# Altium project NNLightSwitcher.PrjPcb (part 3 of 5)

## Sheet NNLightSwitcher_connectors.SchDoc
size A3
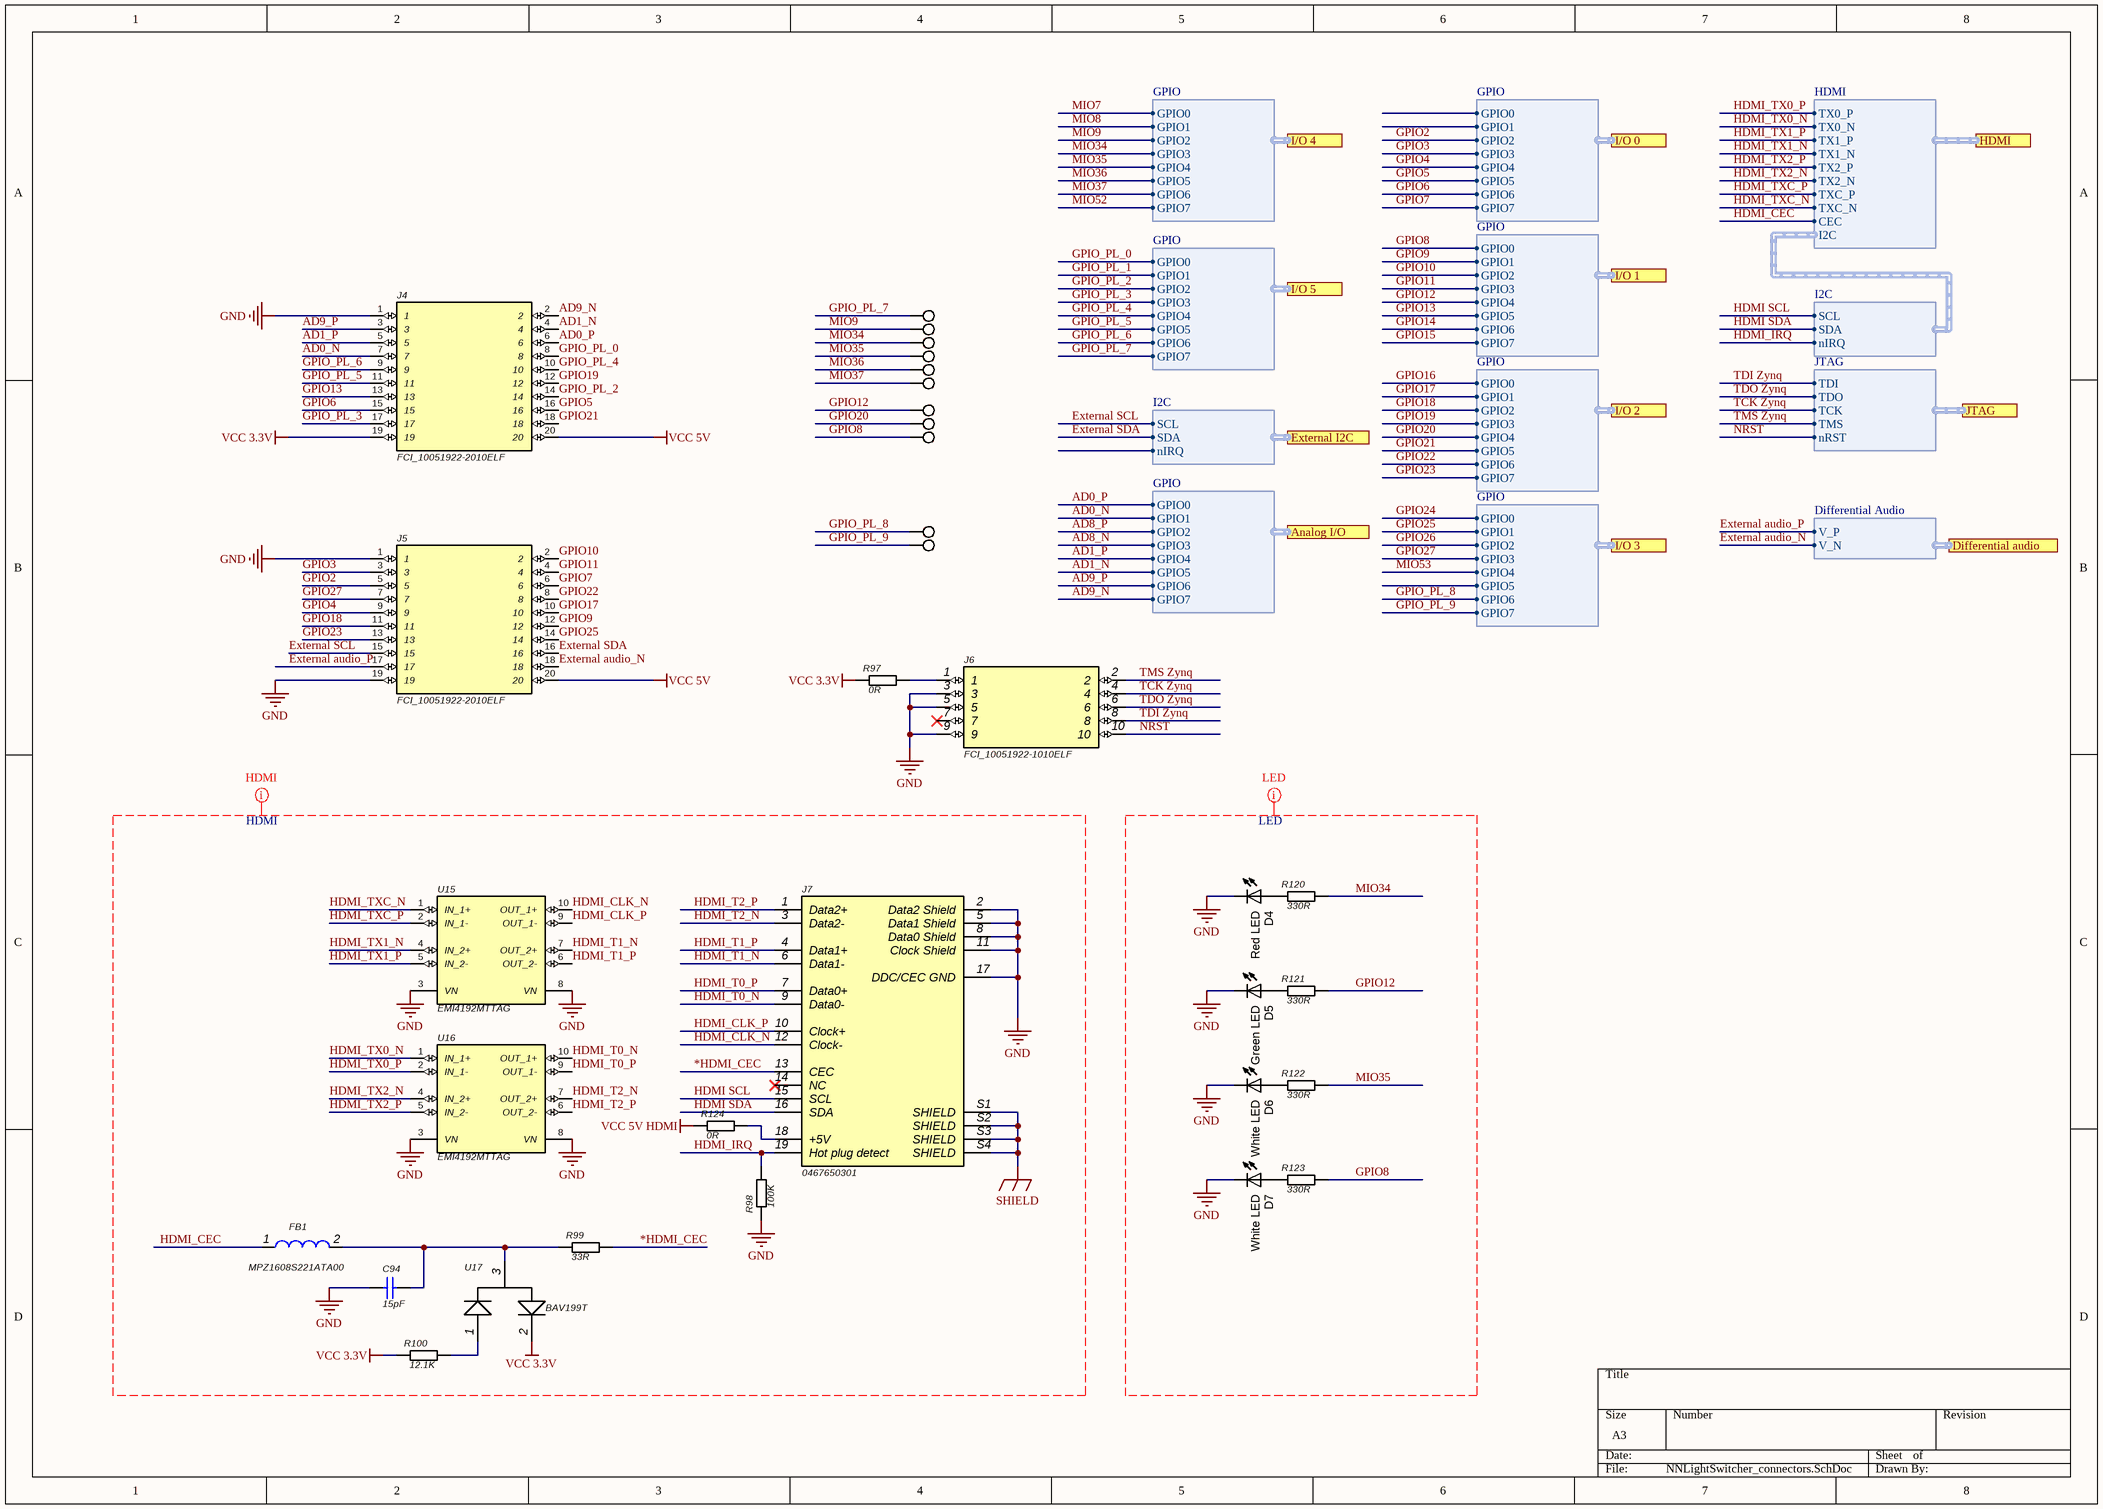
[diagram p10: NNLightSwitcher_connectors.SchDoc]

### Parts
C94  15pF  [0402]
D4  Red LED  [*LED_SML-P11UTT86R_SML-P11MTT86(Primary)]
D5  Green LED  [*LED_SML-P11UTT86R_SML-P11MTT86(Primary)]
D6  White LED  [*LED_SML-P11UTT86R_SML-P11MTT86(Primary)]
D7  White LED  [*LED_SML-P11UTT86R_SML-P11MTT86(Primary)]
FB1  MPZ1608S221ATA00  [*0603]
J4  FCI_10051922-2010ELF  [*FCI_10051922-2010ELF]
J5  FCI_10051922-2010ELF  [*FCI_10051922-2010ELF]
J6  FCI_10051922-1010ELF  [*FCI_10051922-1010ELF]
J7  0467650301  [MOLEX_0467650301_0467650301(Primary)]
R97  0R  [0402]
R98  100K  [0402]
R99  33R  [0402]
R100  12.1K  [0402]
R120  330R  [0402]
R121  330R  [0402]
R122  330R  [0402]
R123  330R  [0402]
R124  0R  [0402]
TP50  Test point  [Testpoint_with_pad]  (value not drawn)
TP51  Test point  [Testpoint_Keystone_Miniature]  (value not drawn)
TP52  Test point  [Testpoint_Keystone_Miniature]  (value not drawn)
TP53  Test point  [Testpoint_Keystone_Miniature]  (value not drawn)
TP54  Test point  [Testpoint_Keystone_Miniature]  (value not drawn)
TP55  Test point  [Testpoint_Keystone_Miniature]  (value not drawn)
TP63  Test point  [Testpoint_with_pad]  (value not drawn)
TP64  Test point  [Testpoint_with_pad]  (value not drawn)
TP65  Test point  [Testpoint_with_pad]  (value not drawn)
TP67  Test point  [Testpoint_with_pad]  (value not drawn)
TP70  Test point  [Testpoint_with_pad]  (value not drawn)
U15  EMI4192MTTAG  [ONSC-WDFN-10-511BM-01_V]
U16  EMI4192MTTAG  [ONSC-WDFN-10-511BM-01_V]
U17  BAV199T  [*SOT95P240X110-3N]

### Ports
Analog I/O (harness GPIO), Differential audio (harness Differential Audio), External I2C (harness I2C), HDMI (harness HDMI), I/O 0 (harness GPIO), I/O 1 (harness GPIO), I/O 2 (harness GPIO), I/O 3 (harness GPIO), I/O 4 (harness GPIO), I/O 5 (harness GPIO), JTAG (harness JTAG)

### Harnesses
GPIO: GPIO7, GPIO6, GPIO5, GPIO4, GPIO3, GPIO2, GPIO1, GPIO0
HDMI: TXC_N, TXC_P, TX2_N, TX2_P, TX1_N, TX1_P, TX0_N, TX0_P, CEC, I2C
I2C: SDA, SCL, nIRQ
JTAG: TMS, TCK, TDO, TDI, nRST
Differential Audio: V_N, V_P

### Nets
GND: C94.2 D4.C D5.C D6.C D7.C J4.1 J5.1 J5.19 J6.3 J6.5 J6.9 J7.2(Data2_Shield) J7.5(Data1_Shield) J7.8(Data0_Shield) J7.11(Clock_Shield) J7.17(DDC/CEC_GND) R98.1 U15.3(VN) U15.8(VN) U16.3(VN) U16.8(VN)
SHIELD: J7.S1(SHIELD) J7.S2(SHIELD) J7.S3(SHIELD) J7.S4(SHIELD)
VCC 3.3V: J4.19 R97.1 R100.1 U17.2(CATHODE)
VCC 5V: J4.20 J5.20
VCC 5V HDMI: R124.1
*HDMI_CEC: J7.13(CEC) R99.2
AD0_N: J4.7 ; port Analog I/O.GPIO1
AD0_P: J4.6 ; port Analog I/O.GPIO0
AD1_N: J4.4 ; port Analog I/O.GPIO5
AD1_P: J4.5 ; port Analog I/O.GPIO4
AD9_N: J4.2 ; port Analog I/O.GPIO7
AD9_P: J4.3 ; port Analog I/O.GPIO6
External audio_N: J5.18 ; port Differential audio.V_N  [project net Audio_N]
External audio_P: J5.17 ; port Differential audio.V_P  [project net Audio_P]
External SCL: J5.15 ; port External I2C.SCL
External SDA: J5.16 ; port External I2C.SDA
GPIO2: J5.5 ; port I/O 0.GPIO2
GPIO3: J5.3 ; port I/O 0.GPIO3
GPIO4: J5.9 ; port I/O 0.GPIO4
GPIO5: J4.16 ; port I/O 0.GPIO5
GPIO6: J4.15 ; port I/O 0.GPIO6
GPIO7: J5.6 ; port I/O 0.GPIO7
GPIO8: R123.2 TP65.1 ; port I/O 1.GPIO0
GPIO9: J5.12 ; port I/O 1.GPIO1
GPIO10: J5.2 ; port I/O 1.GPIO2
GPIO11: J5.4 ; port I/O 1.GPIO3
GPIO12: R121.2 TP63.1 ; port I/O 1.GPIO4
GPIO13: J4.13 ; port I/O 1.GPIO5
GPIO17: J5.10 ; port I/O 2.GPIO1
GPIO18: J5.11 ; port I/O 2.GPIO2
GPIO19: J4.12 ; port I/O 2.GPIO3
GPIO20: TP64.1 ; port I/O 2.GPIO4
GPIO21: J4.18 ; port I/O 2.GPIO5
GPIO22: J5.8 ; port I/O 2.GPIO6
GPIO23: J5.13 ; port I/O 2.GPIO7
GPIO25: J5.14 ; port I/O 3.GPIO1
GPIO27: J5.7 ; port I/O 3.GPIO3
GPIO_PL_0: J4.8 ; port I/O 5.GPIO0
GPIO_PL_2: J4.14 ; port I/O 5.GPIO2
GPIO_PL_3: J4.17 ; port I/O 5.GPIO3
GPIO_PL_4: J4.10 ; port I/O 5.GPIO4
GPIO_PL_5: J4.11 ; port I/O 5.GPIO5
GPIO_PL_6: J4.9 ; port I/O 5.GPIO6
GPIO_PL_7: TP50.1 ; port I/O 5.GPIO7
GPIO_PL_8: TP67.1 ; port I/O 3.GPIO6
GPIO_PL_9: TP70.1 ; port I/O 3.GPIO7
HDMI SCL: J7.15(SCL) ; harness I2C.SCL
HDMI SDA: J7.16(SDA) ; harness I2C.SDA
HDMI_CEC: FB1.1 ; port HDMI.CEC
HDMI_CLK_N: J7.12(Clock-) U15.10(OUT_1+)
HDMI_CLK_P: J7.10(Clock+) U15.9(OUT_1-)
HDMI_IRQ: J7.19(Hot_plug_detect) R98.2 ; harness I2C.nIRQ
HDMI_T0_N: J7.9(Data0-) U16.10(OUT_1+)
HDMI_T0_P: J7.7(Data0+) U16.9(OUT_1-)
HDMI_T1_N: J7.6(Data1-) U15.7(OUT_2+)
HDMI_T1_P: J7.4(Data1+) U15.6(OUT_2-)
HDMI_T2_N: J7.3(Data2-) U16.7(OUT_2+)
HDMI_T2_P: J7.1(Data2+) U16.6(OUT_2-)
HDMI_TX0_N: U16.1(IN_1+) ; port HDMI.TX0_N
HDMI_TX0_P: U16.2(IN_1-) ; port HDMI.TX0_P
HDMI_TX1_N: U15.4(IN_2+) ; port HDMI.TX1_N
HDMI_TX1_P: U15.5(IN_2-) ; port HDMI.TX1_P
HDMI_TX2_N: U16.4(IN_2+) ; port HDMI.TX2_N
HDMI_TX2_P: U16.5(IN_2-) ; port HDMI.TX2_P
HDMI_TXC_N: U15.1(IN_1+) ; port HDMI.TXC_N
HDMI_TXC_P: U15.2(IN_1-) ; port HDMI.TXC_P
MIO9: TP51.1 ; port I/O 4.GPIO2
MIO34: R120.2 TP52.1 ; port I/O 4.GPIO3
MIO35: R122.2 TP53.1 ; port I/O 4.GPIO4
MIO36: TP54.1 ; port I/O 4.GPIO5
MIO37: TP55.1 ; port I/O 4.GPIO6
MIO52: port I/O 4.GPIO7
MIO53: port I/O 3.GPIO4
NRST: J6.10 ; port JTAG.nRST  [project net nMRST]
TCK Zynq: J6.4 ; port JTAG.TCK
TDI Zynq: J6.8 ; port JTAG.TDI
TDO Zynq: J6.6 ; port JTAG.TDO
TMS Zynq: J6.2 ; port JTAG.TMS
NetC94_1: C94.1 FB1.2 R99.1 U17.3(ANODE/CATHODE)
NetD4_A: D4.A R120.1
NetD5_A: D5.A R121.1
NetD6_A: D6.A R122.1
NetD7_A: D7.A R123.1
NetJ6_1: J6.1 R97.2
NetJ7_18: J7.18(+5V) R124.2
NetR100_2: R100.2 U17.1(ANODE)

Not connected (* = marked no-connect by the designer): J6 7*; J7 14(NC)*

### Layout directives
net class HDMI: *HDMI_CEC, GND, HDMI SCL, HDMI SDA, HDMI_CEC, HDMI_CLK_N, HDMI_CLK_P, HDMI_IRQ, HDMI_T0_N, HDMI_T0_P, HDMI_T1_N, HDMI_T1_P, HDMI_T2_N, HDMI_T2_P, HDMI_TX0_N, HDMI_TX0_P, HDMI_TX1_N, HDMI_TX1_P, HDMI_TX2_N, HDMI_TX2_P, HDMI_TXC_N, HDMI_TXC_P, SHIELD, VCC 3.3V, VCC 5V HDMI
net class LED: GND, GPIO8, GPIO12, MIO34, MIO35

### Library data of the parts
C94 = Capacitor 15pF: ComponentLink1Description: Datasheet link; ComponentLink1URL: http://www.yageo.com/documents/recent/UPY-GP_NP0_16V-to-50V_16.pdf
D4 = APHHS1005SURCK: LED red 0402; Manufacturer 1: Kingbright; Lens Color: Clear; Forward Current: 20mA; Forward Voltage: 1.95V; Luminous Intensity: 220mcd; Viewing Angle: 120°; Lens Style: Clear,Flat; Dominant Wavelength: 630nm; Number of LEDs: 1; Wavelength: 635nm; ComponentLink1URL: https://datasheet.ciiva.com/15198/getdatasheetpartid-569583-15198505.pdf?src-supplier=Verical; ComponentLink1Description: https://datasheet.ciiva.com/15198/getdatasheetpartid-569583-15198505.pdf?src-supplier=Verical; Supplier 1: Digi-Key; Manufacturer Part Number 1: APHHS1005SURCK; Stock 1: 30423; Pricing 1: 1=0,42000, 10=0,30400, 100=0,19820, 500=0,14248, 1000=0,11151 (USD); RoHS: Yes; Mount: Surface Mount; Case/Package: 0402; Number of Pins: 2; Color: Red; Case Code (Metric): 1005; Case Code (Imperial): 0402; Min Operating Temperature: -40°C; Max Operating Temperature: 85°C; Illumination Color: Red; Packaging: Tape and Reel; Package Quantity: 2000; Test Current: 20mA; Length: 1mm; Height: 0.6mm; Width: 0.5mm; Lead Free: Lead Free; ComponentLink2URL: https://datasheet.ciiva.com/2114/aphhs1005surck-2114140.pdf?src-supplier=Digi-Key; ComponentLink2Description: https://datasheet.ciiva.com/2114/aphhs1005surck-2114140.pdf?src-supplier=Digi-Key; ComponentLink3URL: https://datasheet.ciiva.com/4689/aphhs1005surck-32322-4689068.pdf?src-supplier=Mouser; ComponentLink3Description: https://datasheet.ciiva.com/4689/aphhs1005surck-32322-4689068.pdf?src-supplier=Mouser; ComponentLink4URL: https://datasheet.ciiva.com/14603/70062833-14603899.pdf?src-supplier=Allied+Electronics; ComponentLink4Description: https://datasheet.ciiva.com/14603/70062833-14603899.pdf?src-supplier=Allied+Electronics; ComponentLink5URL: https://datasheet.ciiva.com/2114/aphhs1005surck-2114141.pdf?src-supplier=Digi-Key; ComponentLink5Description: https://datasheet.ciiva.com/2114/aphhs1005surck-2114141.pdf?src-supplier=Digi-Key; ComponentLink6URL: https://datasheet.ciiva.com/2114/aphhs1005surck-2114142.pdf?src-supplier=Digi-Key; ComponentLink6Description: https://datasheet.ciiva.com/2114/aphhs1005surck-2114142.pdf?src-supplier=Digi-Key
D5 = LT_VH9G-Q2OO-25-1: LED Uni-Color Green 525nm 2-Pin Chip 0402_1006Metric_ T/RLT_VH9G-Q2OO-25-1; Manufacturer 1: Osram Opto; Manufacturer Part Number 1: LTVH9G-Q2OO-25-1; Luminous Intensity: 280mcd; Forward Current: 15mA; Forward Voltage: 3.2V; Lens Style: Diffused,Colorless,Rectangular; Test Current: 5mA; Dominant Wavelength: 532nm; Luminous Flux: 0.55lm; Number of Elements: 1; Reverse Voltage: 5V; Supplier 1: Digi-Key; Stock 1: 5742; Pricing 1: 1=0,57000, 10=0,44100, 100=0,28300, 500=0,24334, 1000=0,18788 (USD); RoHS: Yes; Mount: Surface Mount; Case/Package: SMD/SMT; Number of Pins: 2; Color: Green; Min Operating Temperature: -40°C; Max Operating Temperature: 85°C; Packaging: Tape and Reel; Number of LEDs: 1; Length: 1.1mm; Depth: 0.35mm; Radiation Hardening: No; ComponentLink1URL: https://datasheet.ciiva.com/15198/getdatasheetpartid-569583-15198505.pdf?src-supplier=Verical; ComponentLink1Description: https://datasheet.ciiva.com/15198/getdatasheetpartid-569583-15198505.pdf?src-supplier=Verical
D6 D7 = APG1005RWF-T-5MAV: LED red 0402 / APG1005RWF-T-5MAV; Manufacturer 1: Kingbright; Lens Color: Yellow; Luminous Intensity: 85mcd; Test Current: 5mA; Viewing Angle: 120°; Forward Voltage: 2.9V; ComponentLink1URL: https://datasheet.ciiva.com/15198/getdatasheetpartid-569583-15198505.pdf?src-supplier=Verical; ComponentLink1Description: https://datasheet.ciiva.com/15198/getdatasheetpartid-569583-15198505.pdf?src-supplier=Verical; ComponentLink2URL: https://datasheet.ciiva.com/2114/aphhs1005surck-2114140.pdf?src-supplier=Digi-Key; ComponentLink2Description: https://datasheet.ciiva.com/2114/aphhs1005surck-2114140.pdf?src-supplier=Digi-Key; ComponentLink3URL: https://datasheet.ciiva.com/4689/aphhs1005surck-32322-4689068.pdf?src-supplier=Mouser; ComponentLink3Description: https://datasheet.ciiva.com/4689/aphhs1005surck-32322-4689068.pdf?src-supplier=Mouser; ComponentLink4URL: https://datasheet.ciiva.com/14603/70062833-14603899.pdf?src-supplier=Allied+Electronics; ComponentLink4Description: https://datasheet.ciiva.com/14603/70062833-14603899.pdf?src-supplier=Allied+Electronics; ComponentLink5URL: https://datasheet.ciiva.com/2114/aphhs1005surck-2114141.pdf?src-supplier=Digi-Key; ComponentLink5Description: https://datasheet.ciiva.com/2114/aphhs1005surck-2114141.pdf?src-supplier=Digi-Key; ComponentLink6URL: https://datasheet.ciiva.com/2114/aphhs1005surck-2114142.pdf?src-supplier=Digi-Key; ComponentLink6Description: https://datasheet.ciiva.com/2114/aphhs1005surck-2114142.pdf?src-supplier=Digi-Key; Supplier 1: Digi-Key; Manufacturer Part Number 1: APG1005RWF-T-5MAV; Stock 1: 14703; Pricing 1: 1=0,61000, 10=0,47900, 100=0,30710, 500=0,26412, 1000=0,20393 (USD); RoHS: Yes; Mount: Surface Mount; Case/Package: 0402; Color: White; Case Code (Metric): 1005; Case Code (Imperial): 0402; Package Quantity: 1; Packaging: Tape and Reel; Length: 1mm; Height: 0.25mm; Width: 0.5mm; Lead Free: Lead Free; ComponentLink7URL: https://datasheet.ciiva.com/29562/apg1005rwf-t-5mav-29562261.pdf?src-supplier=Digi-Key; ComponentLink7Description: https://datasheet.ciiva.com/29562/apg1005rwf-t-5mav-29562261.pdf?src-supplier=Digi-Key; ComponentLink8URL: https://datasheet.ciiva.com/29562/apg1005rwf-t-5mav-29562262.pdf?src-supplier=Digi-Key; ComponentLink8Description: https://datasheet.ciiva.com/29562/apg1005rwf-t-5mav-29562262.pdf?src-supplier=Digi-Key; ComponentLink9URL: https://datasheet.ciiva.com/29562/apg1005rwf-t-5mav-29562263.pdf?src-supplier=Digi-Key; ComponentLink9Description: https://datasheet.ciiva.com/29562/apg1005rwf-t-5mav-29562263.pdf?src-supplier=Digi-Key
FB1 = MPZ1608S221ATA00: Ferrite Bead Multi-Layer 220Ohm 25% 100MHz Ferrite 2.2A 0603 Punched Paper T/R; Manufacturer 1: TDK; DC Resistance (DCR): 50mR; Impedance: 220R; Value: *; Case/Package: 0603; Case Code (Imperial): 0603; Case Code (Metric): 1608; ComponentLink1Description: https://datasheet.ciiva.com/8077/55167-8077073.pdf?src-supplier=Element14; ComponentLink1URL: https://datasheet.ciiva.com/8077/55167-8077073.pdf?src-supplier=Element14; ComponentLink2Description: https://datasheet.ciiva.com/46366/print-detail-pdf-phplangenpart-nompz1608s221ata00nreimp-unit-xmhz-46366044.pdf?src-supplier=Onlinecomponents.com; ComponentLink2URL: https://datasheet.ciiva.com/46366/print-detail-pdf-phplangenpart-nompz1608s221ata00nreimp-unit-xmhz-46366044.pdf?src-supplier=Onlinecomponents.com; ComponentLink3Description: https://datasheet.ciiva.com/46381/1486324-46381628.pdf?src-supplier=Element14; ComponentLink3URL: https://datasheet.ciiva.com/46381/1486324-46381628.pdf?src-supplier=Element14; ComponentLink4Description: https://datasheet.ciiva.com/8077/55167-8077071.pdf?src-supplier=Element14; ComponentLink4URL: https://datasheet.ciiva.com/8077/55167-8077071.pdf?src-supplier=Element14; Core Material: Ferrite; Current Rating: 2.2A; Height: 0.037inch; Lead Free: Lead Free; Length: 0.063inch; Manufacturer 2: TDK; Manufacturer Part Number 1: MPZ1608S221ATA00; Manufacturer Part Number 2: MPZ1608S221ATA00; Max DC Current: 2.2A; Mount: Surface Mount; Number of Pins: 2; Package Quantity: 1; Packaging: Cut Tape; Pricing 1: 1=0,10000, 10=0,07900, 25=0,07160, 50=0,06440, 100=0,04720, 250=0,03432, 500=0,03146, 1000=0,02717 (USD); Pricing 2: 1=0,10000, 10=0,07800, 50=0,07800, 100=0,04700, 500=0,03100, 1000=0,02700, 4000=0,02000, 10000=0,02000 (USD); REACH SVHC: No SVHC; RoHS: Yes; Stock 1: 578094; Stock 2: 146793; Supplier 1: Digi-Key; Supplier 2: Mouser; Supplier Part Number 1: 445-1565-1-ND; Supplier Part Number 2: 810-MPZ1608S221ATA00; Tolerance: 25%; Width: 0.031inch
J4 J5 = FCI_10051922-2010ELF: 0.50mm FFC/FPC Connectors 20CKT RA SMT ZIF CON BOTTOM CONTACT; Manufacturer 1: Amphenol FCI; Actuator Material: Nylon,Glass,Polyamide; Number of Contacts: 20; Contact Resistance: 30mR; Current Rating: 500mA; Voltage Rating: 50V; Insulation Resistance: 100MR; Pitch: 0.5mm; Supplier 1: Digi-Key; Manufacturer Part Number 1: 10051922-2010ELF; Stock 1: 913; Pricing 1: 1=0,73000, 10=0,64500, 25=0,60760, 50=0,58220, 100=0,55680, 250=0,50624, 500=0,45560, 1000=0,40498 (USD); RoHS: Yes; Mount: Surface Mount; Contact Material: Copper Alloy,Bronze,Copper; Contact Plating: Gold; Housing Color: Natural; Housing Material: Polymer; Min Operating Temperature: -55°C; Max Operating Temperature: 85°C; Number of Rows: 1; Termination: Solder; Orientation: Right Angle; Packaging: Tape and Reel; Package Quantity: 4500; Number of Positions: 20; Contact Location: Bottom; Max Voltage Rating (AC): 50V; Max Voltage Rating (DC): 50V; Length: 12.5mm; Depth: 3.4mm; Width: 3.4mm; Radiation Hardening: No; REACH SVHC: No SVHC; Lead Free: Lead Free; Flammability Rating: UL94 V-0; ComponentLink1URL: https://datasheet.ciiva.com/673/10051922-673159.pdf?src-supplier=Digi-Key; ComponentLink1Description: https://datasheet.ciiva.com/673/10051922-673159.pdf?src-supplier=Digi-Key; ComponentLink2URL: https://datasheet.ciiva.com/1437/10051922-1437497.pdf?src-supplier=Element14; ComponentLink2Description: https://datasheet.ciiva.com/1437/10051922-1437497.pdf?src-supplier=Element14; ComponentLink3URL: https://datasheet.ciiva.com/16658/10051922-16658794.pdf?src-supplier=Avnet+Europe; ComponentLink3Description: https://datasheet.ciiva.com/16658/10051922-16658794.pdf?src-supplier=Avnet+Europe; ComponentLink4URL: https://datasheet.ciiva.com/673/10051922-673158.pdf?src-supplier=Digi-Key; ComponentLink4Description: https://datasheet.ciiva.com/673/10051922-673158.pdf?src-supplier=Digi-Key; Supplier 2: Mouser; Manufacturer 2: Amphenol FCI; Manufacturer Part Number 2: 10051922-2010ELF; Stock 2: 2006; Pricing 2: 1=0,73000, 10=0,58300, 50=0,58300, 100=0,50700, 500=0,45600, 1000=0,40500, 2500=0,34600, 9000=0,30700, 10000=0,30700, 22500=0,30000 (USD); Supplier Part Number 1: 609-1240-1-ND; Supplier Part Number 2: 649-10051922-2010ELF
J6 = FCI_10051922-1010ELF: 0.50mm FFC/FPC Connectors 10CKT RA SMT ZIF CON BOTTOM CONTACT; Manufacturer 1: Amphenol FCI; Actuator Material: Nylon,Glass,Polyamide; Number of Contacts: 10; Contact Resistance: 30mR; Current Rating: 500mA; Voltage Rating: 50V; Insulation Resistance: 100MR; Gender: Female; Pitch: 0.5mm; Supplier 1: Digi-Key; Manufacturer Part Number 1: 10051922-1010ELF; Stock 1: 3851; Pricing 1: 1=0,85000, 10=0,74400, 25=0,70080, 50=0,67140, 100=0,64230, 250=0,58388, 500=0,52550, 1000=0,46710 (USD); RoHS: Yes; Mount: Surface Mount; Contact Material: Copper Alloy,Bronze; Contact Plating: Gold; Housing Color: Natural; Housing Material: Polymer; Min Operating Temperature: -55°C; Max Operating Temperature: 85°C; Number of Rows: 1; Termination: Solder; Orientation: Right Angle; Packaging: Tape and Reel; Package Quantity: 4500; Number of Positions: 10; Contact Location: Bottom; Max Voltage Rating (AC): 50V; Max Voltage Rating (DC): 50V; Length: 7.5mm; Depth: 3.4mm; Width: 3.4mm; Radiation Hardening: No; REACH SVHC: No SVHC; Lead Free: Lead Free; Flammability Rating: UL94 V-0; ComponentLink1URL: https://datasheet.ciiva.com/1437/10051922-1437495.pdf?src-supplier=Element14; ComponentLink1Description: https://datasheet.ciiva.com/1437/10051922-1437495.pdf?src-supplier=Element14; ComponentLink2URL: https://datasheet.ciiva.com/15176/getdatasheetpartid-131484-15176375.pdf?src-supplier=Verical; ComponentLink2Description: https://datasheet.ciiva.com/15176/getdatasheetpartid-131484-15176375.pdf?src-supplier=Verical; ComponentLink3URL: https://datasheet.ciiva.com/670/10051922-670057.pdf?src-supplier=Digi-Key; ComponentLink3Description: https://datasheet.ciiva.com/670/10051922-670057.pdf?src-supplier=Digi-Key; ComponentLink4URL: https://datasheet.ciiva.com/670/10051922-670058.pdf?src-supplier=Digi-Key; ComponentLink4Description: https://datasheet.ciiva.com/670/10051922-670058.pdf?src-supplier=Digi-Key; ComponentLink5URL: https://datasheet.ciiva.com/5136/fcicmd-catcustomerdrawingproductname-10051922-1010elf-5136554.pdf?src-supplier=Mouser; ComponentLink5Description: https://datasheet.ciiva.com/5136/fcicmd-catcustomerdrawingproductname-10051922-1010elf-5136554.pdf?src-supplier=Mouser; ComponentLink6URL: https://datasheet.ciiva.com/670/10051922-670059.pdf?src-supplier=Digi-Key; ComponentLink6Description: https://datasheet.ciiva.com/670/10051922-670059.pdf?src-supplier=Digi-Key; ComponentLink7URL: https://datasheet.ciiva.com/10367/10051922-10367679.pdf?src-supplier=Avnet; ComponentLink7Description: https://datasheet.ciiva.com/10367/10051922-10367679.pdf?src-supplier=Avnet; Supplier 2: Mouser; Manufacturer 2: Amphenol FCI; Manufacturer Part Number 2: 10051922-1010ELF; Stock 2: 5616; Pricing 2: 1=0,85000, 10=0,67200, 50=0,67200, 100=0,64300, 250=0,58400, 500=0,52600, 1000=0,46800, 2500=0,40300, 4500=0,38500, 9000=0,34600, 10000=0,34600 (USD); Supplier Part Number 1: 609-1234-1-ND; Supplier Part Number 2: 649-10051922-1010ELF
J7 = Micro HDMI: Conn Micro HDMI RCP 19 POS 0.4mm Solder RA SMD 19 Terminal 1 Port Micro HDMI Embossed T/R; Manufacturer 1: Molex; Manufacturer Part Number 1: 46765-0301; Number of Contacts: 19; Gender: Receptacle; Number of Ports: 1; Supplier 1: Mouser; Stock 1: 3234; Pricing 1: 1=1,66000, 10=1,56000, 25=1,49000, 50=1,42000, 100=1,29000, 250=1,19000, 500=1,02000, 1000=0,94500, 2000=0,89800, 10000=0,89800 (USD); RoHS: Yes; Mount: Surface Mount,Horizontal; Contact Material: Copper Alloy; Contact Plating: Gold; Number of Terminals: 19; Housing Material: Thermoplastic; Packaging: Tape and Reel; Package Quantity: 4000; Connector Type: HDMI; Termination: Solder; Orientation: Right Angle; Features: Shielded; Length: 6.5mm; Pitch: 0.4mm; Depth: 7.5mm; Radiation Hardening: No; ComponentLink1URL: https://datasheet.ciiva.com/6731/467651001-sd-6731010.pdf?src-supplier=Digi-Key; ComponentLink1Description: https://datasheet.ciiva.com/6731/467651001-sd-6731010.pdf?src-supplier=Digi-Key; ComponentLink2URL: https://datasheet.ciiva.com/10945/0467650301-io-connectors-10945240.pdf?src-supplier=Avnet; ComponentLink2Description: https://datasheet.ciiva.com/10945/0467650301-io-connectors-10945240.pdf?src-supplier=Avnet; Supplier Part Number 1: 538-46765-0301
R97 R124 = Resistor 0R
R98 = Resistor 100K
R99 = Resistor 33R
R100 = Resistor 12.1K
R120-R123 = Resistor 330R
TP50-TP55 TP63-TP65 TP67 TP70 = Test point: Test Point, Miniature, SMT; ComponentLink1Description: Datasheet URL; ComponentLink1URL: http://www.keyelco.com/userAssets/store/files/5015.PDF
U15 U16 = EMI4192MTTAG: Common Mode Filter with ESD Protection, -40 to 85 degC, 10-Pin WDFN, Pb-Free, Tape and Reel; Manufacturer 1: ON Semiconductor; Number of Lines: 4; Capacitance: 0.8pF; Clamping Voltage: 18V; Current: 100mA; DC Resistance (DCR): 5R; Direction: Unidirectional; ESD Protection: Yes; Impedance: 32R; Max Reverse Leakage Current: 1uA; Min Breakdown Voltage: 5.6V; Reverse Standoff Voltage: 5V; Test Current: 1mA; ComponentLink1Description: Manufacturer URL; ComponentLink2Description: Datasheet; ComponentLink3Description: Package Specification; ComponentLink3URL: http://www.onsemi.cn/pub_link/Collateral/511BM.PDF; ComponentLink1URL: http://www.onsemi.com/; ComponentLink2URL: http://www.onsemi.cn/pub_link/Collateral/EMI4192-D.PDF; RoHS: Yes; ComponentLink4Description: https://datasheet.ciiva.com/6215/emi4192-d-6215568.pdf?src-supplier=Digi-Key; ComponentLink4URL: https://datasheet.ciiva.com/6215/emi4192-d-6215568.pdf?src-supplier=Digi-Key; ComponentLink5Description: https://datasheet.ciiva.com/12394/emi4192-d-117518-12394999.pdf?src-supplier=Mouser; ComponentLink5URL: https://datasheet.ciiva.com/12394/emi4192-d-117518-12394999.pdf?src-supplier=Mouser; Depth: 2mm; Halogen Free: Halogen Free; Height: 0.031inch; Lead Free: Lead Free; Length: 2.5mm; Manufacturer 2: ON Semiconductor; Manufacturer Part Number 1: EMI4192MTTAG; Manufacturer Part Number 2: EMI4192MTTAG; Max Current Rating: 100mA; Max DC Current: 100mA; Max Operating Temperature: 85°C; Min Operating Temperature: -40°C; Number of Pins: 10; Package Quantity: 3000; Packaging: Tape and Reel; Pricing 1: 1=0,77000, 10=0,68000, 100=0,52120, 500=0,41200, 1000=0,32960 (USD); Pricing 2: 1=0,74000, 10=0,62000, 50=0,62000, 100=0,40000, 1000=0,32000, 3000=0,27100, 9000=0,26100, 10000=0,26100, 24000=0,25000, 45000=0,24700, 99000=0,24100 (USD); Radiation Hardening: No; Stock 1: 1265; Stock 2: 304; Supplier 1: Digi-Key; Supplier 2: Mouser; Supplier Part Number 1: EMI4192MTTAGOSCT-ND; Supplier Part Number 2: 863-EMI4192MTTAG; Termination: Flat; Width: 2mm
U17 = BAV199T: DIODE, SS, DUAL, 85V, 0.125A, SOT523; Diode Type: Standard Recovery; Forward Current If_AV_: 215mA; Repetitive Revers...; Manufacturer 1: Diodes; Manufacturer Part Number 1: BAS40-04-7-F; MF: Micro Commercial; Average Rectified Current: 200mA; Capacitance: 5pF; Forward Voltage: 1V; Max Forward Surge Current (Ifsm): 600mA; Max Power Dissipation: 350mW; Max Repetitive Reverse Voltage (Vrrm): 40V; Peak Reverse Current: 200nA; Reverse Recovery Time: 5ns; Package: SOT-23 Micro Commercial; MP: BAV199T; Availability: Unavailable; Price: None; SnapEDA_Link: https://www.snapeda.com/parts/BAV199T/Micro%20Commercial/view-part/?ref=snap; Value: *; Case/Package: SOT-23; ComponentLink1Description: https://datasheet.ciiva.com/25946/ds11006-25946962.pdf?src-supplier=Avnet+Europe; ComponentLink1URL: https://datasheet.ciiva.com/25946/ds11006-25946962.pdf?src-supplier=Avnet+Europe; ComponentLink2Description: https://datasheet.ciiva.com/1177/ds11006-1177656.pdf?src-supplier=Element14; ComponentLink2URL: https://datasheet.ciiva.com/1177/ds11006-1177656.pdf?src-supplier=Element14; ComponentLink3Description: https://datasheet.ciiva.com/16379/ds11006-16379065.pdf?src-supplier=Future+Electronics; ComponentLink3URL: https://datasheet.ciiva.com/16379/ds11006-16379065.pdf?src-supplier=Future+Electronics; ComponentLink4Description: https://datasheet.ciiva.com/8303/ds11006-8303212.pdf?src-supplier=Avnet; ComponentLink4URL: https://datasheet.ciiva.com/8303/ds11006-8303212.pdf?src-supplier=Avnet; ComponentLink5Description: https://datasheet.ciiva.com/22695/1911827-22695788.pdf?src-supplier=Element14; ComponentLink5URL: https://datasheet.ciiva.com/22695/1911827-22695788.pdf?src-supplier=Element14; ComponentLink6Description: https://datasheet.ciiva.com/4715/ds11006-4715662.pdf?src-supplier=Mouser; ComponentLink6URL: https://datasheet.ciiva.com/4715/ds11006-4715662.pdf?src-supplier=Mouser; Contact Plating: Tin,Matte; Forward Current: 200mA; Height: 1mm; Lead Free: Lead Free; Length: 3.05mm; Max Operating Temperature: 125°C; Max Reverse Voltage (DC): 40V; Min Operating Temperature: -55°C; Mount: Surface Mount; Number of Pins: 3; Package Quantity: 3000; Packaging: Tape and Reel; Peak Non-Repetitive Surge Current: 600mA; Power Dissipation: 350mW; Power Rating: 350mW; Pricing 1: 1=0,33000, 10=0,21700, 50=0,21700, 100=0,09300, 1000=0,07200, 3000=0,05400, 9000=0,04800, 10000=0,04800, 24000=0,04500 (USD); Radiation Hardening: No; REACH SVHC: No SVHC; RoHS: Yes; Stock 1: 161984; Supplier 1: Mouser; Supplier Part Number 1: 621-BAS40-04-F; Termination: SMD/SMT; Weight: 0.000282oz; Width: 1.4mm